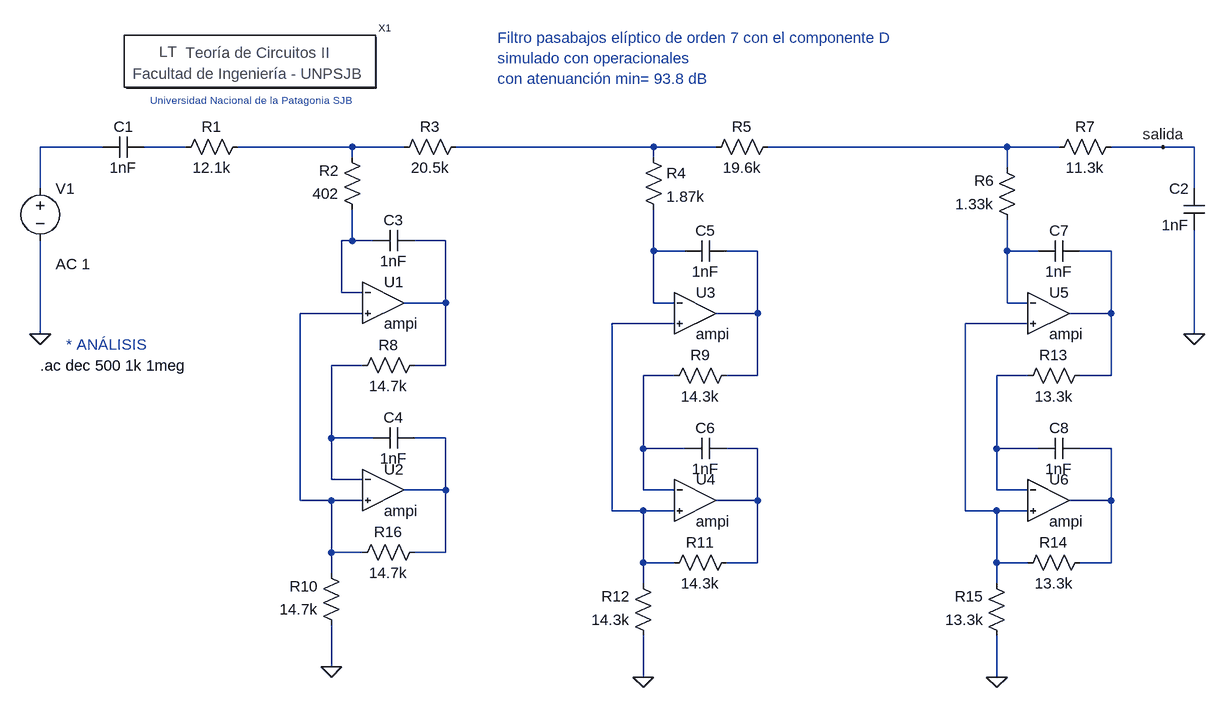
[diagram p0: schematic Filtro eliptico pasabajos de 7 orden con componente D simulado con operacionales.asc]
Filtro eliptico pasabajos de 7 orden con componente D simulado con operacionales.asc, the LTspice schematic file:
Version 4
SHEET 1 880 680
WIRE -944 -352 -1040 -352
WIRE -816 -352 -880 -352
WIRE -560 -352 -736 -352
WIRE -480 -352 -560 -352
WIRE -96 -352 -400 -352
WIRE 0 -352 -96 -352
WIRE 448 -352 80 -352
WIRE 528 -352 448 -352
WIRE 688 -352 608 -352
WIRE 736 -352 688 -352
WIRE -560 -336 -560 -352
WIRE -96 -336 -96 -352
WIRE 448 -320 448 -352
WIRE -1040 -288 -1040 -352
WIRE 736 -288 736 -352
WIRE -560 -208 -560 -256
WIRE -560 -208 -576 -208
WIRE -528 -208 -560 -208
WIRE -416 -208 -464 -208
WIRE -96 -192 -96 -256
WIRE -48 -192 -96 -192
WIRE 64 -192 16 -192
WIRE 448 -192 448 -240
WIRE 496 -192 448 -192
WIRE 608 -192 560 -192
WIRE -576 -128 -576 -208
WIRE -544 -128 -576 -128
WIRE -416 -112 -416 -208
WIRE -416 -112 -480 -112
WIRE -96 -112 -96 -192
WIRE -64 -112 -96 -112
WIRE 448 -112 448 -192
WIRE 480 -112 448 -112
WIRE -544 -96 -640 -96
WIRE 64 -96 64 -192
WIRE 64 -96 0 -96
WIRE 608 -96 608 -192
WIRE 608 -96 544 -96
WIRE -64 -80 -160 -80
WIRE 480 -80 384 -80
WIRE -1040 -64 -1040 -208
WIRE 736 -64 736 -224
WIRE -544 -16 -592 -16
WIRE -416 -16 -416 -112
WIRE -416 -16 -464 -16
WIRE -64 0 -112 0
WIRE 64 0 64 -96
WIRE 64 0 16 0
WIRE 480 0 432 0
WIRE 608 0 608 -96
WIRE 608 0 560 0
WIRE -592 96 -592 -16
WIRE -528 96 -592 96
WIRE -416 96 -464 96
WIRE -112 112 -112 0
WIRE -48 112 -112 112
WIRE 64 112 16 112
WIRE 432 112 432 0
WIRE 496 112 432 112
WIRE 608 112 560 112
WIRE -592 160 -592 96
WIRE -544 160 -592 160
WIRE -416 176 -416 96
WIRE -416 176 -480 176
WIRE -112 176 -112 112
WIRE -64 176 -112 176
WIRE 432 176 432 112
WIRE 480 176 432 176
WIRE -640 192 -640 -96
WIRE -592 192 -640 192
WIRE -544 192 -592 192
WIRE 64 192 64 112
WIRE 64 192 0 192
WIRE 608 192 608 112
WIRE 608 192 544 192
WIRE -160 208 -160 -80
WIRE -112 208 -160 208
WIRE -64 208 -112 208
WIRE 384 208 384 -80
WIRE 432 208 384 208
WIRE 480 208 432 208
WIRE -592 272 -592 192
WIRE -544 272 -592 272
WIRE -416 272 -416 176
WIRE -416 272 -464 272
WIRE -112 288 -112 208
WIRE -64 288 -112 288
WIRE 64 288 64 192
WIRE 64 288 16 288
WIRE 432 288 432 208
WIRE 480 288 432 288
WIRE 608 288 608 192
WIRE 608 288 560 288
WIRE -592 304 -592 272
WIRE -112 320 -112 288
WIRE 432 320 432 288
WIRE -592 448 -592 384
WIRE -112 464 -112 400
WIRE 432 464 432 400
FLAG -592 448 0
FLAG 736 -64 0
FLAG -1040 -64 0
FLAG 688 -352 salida
FLAG -112 464 0
FLAG 432 464 0
SYMBOL voltage -1040 -304 R0
WINDOW 123 24 132 Left 2
WINDOW 39 0 0 Left 2
SYMATTR Value2 AC 1
SYMATTR InstName V1
SYMATTR Value ""
SYMBOL cap -880 -368 R90
WINDOW 0 0 32 VBottom 2
WINDOW 3 32 32 VTop 2
SYMATTR InstName C1
SYMATTR Value 1nF
SYMBOL cap 752 -224 R180
WINDOW 0 24 64 Left 2
WINDOW 3 24 8 Left 2
SYMATTR InstName C2
SYMATTR Value 1nF
SYMBOL res -720 -368 R90
WINDOW 0 0 56 VBottom 2
WINDOW 3 32 56 VTop 2
SYMATTR InstName R1
SYMATTR Value 12.1k
SYMBOL res -544 -240 R180
WINDOW 0 36 76 Left 2
WINDOW 3 36 40 Left 2
SYMATTR InstName R2
SYMATTR Value 402
SYMBOL res -496 -336 R270
WINDOW 0 32 56 VTop 2
WINDOW 3 0 56 VBottom 2
SYMATTR InstName R3
SYMATTR Value 20.5k
SYMBOL res -112 -352 R0
SYMATTR InstName R4
SYMATTR Value 1.87k
SYMBOL res 96 -368 R90
WINDOW 0 0 56 VBottom 2
WINDOW 3 32 56 VTop 2
SYMATTR InstName R5
SYMATTR Value 19.6k
SYMBOL res 464 -224 R180
WINDOW 0 36 76 Left 2
WINDOW 3 36 40 Left 2
SYMATTR InstName R6
SYMATTR Value 1.33k
SYMBOL res 512 -336 R270
WINDOW 0 32 56 VTop 2
WINDOW 3 0 56 VBottom 2
SYMATTR InstName R7
SYMATTR Value 11.3k
SYMBOL ampi -512 -176 R0
SYMATTR InstName U1
SYMBOL ampi -512 112 R0
SYMATTR InstName U2
SYMBOL cap -464 -224 R90
WINDOW 0 0 32 VBottom 2
WINDOW 3 32 32 VTop 2
SYMATTR InstName C3
SYMATTR Value 1nF
SYMBOL cap -464 80 R90
WINDOW 0 0 32 VBottom 2
WINDOW 3 32 32 VTop 2
SYMATTR InstName C4
SYMATTR Value 1nF
SYMBOL res -448 -32 R90
WINDOW 0 0 56 VBottom 2
WINDOW 3 32 56 VTop 2
SYMATTR InstName R8
SYMATTR Value 14.7k
SYMBOL res -448 256 R90
WINDOW 0 0 56 VBottom 2
WINDOW 3 32 56 VTop 2
SYMATTR InstName R16
SYMATTR Value 14.7k
SYMBOL res -576 400 R180
WINDOW 0 36 76 Left 2
WINDOW 3 36 40 Left 2
SYMATTR InstName R10
SYMATTR Value 14.7k
SYMBOL ampi -32 -160 R0
SYMATTR InstName U3
SYMBOL ampi -32 128 R0
SYMATTR InstName U4
SYMBOL cap 16 -208 R90
WINDOW 0 0 32 VBottom 2
WINDOW 3 32 32 VTop 2
SYMATTR InstName C5
SYMATTR Value 1nF
SYMBOL cap 16 96 R90
WINDOW 0 0 32 VBottom 2
WINDOW 3 32 32 VTop 2
SYMATTR InstName C6
SYMATTR Value 1nF
SYMBOL res 32 -16 R90
WINDOW 0 0 56 VBottom 2
WINDOW 3 32 56 VTop 2
SYMATTR InstName R9
SYMATTR Value 14.3k
SYMBOL res 32 272 R90
WINDOW 0 0 56 VBottom 2
WINDOW 3 32 56 VTop 2
SYMATTR InstName R11
SYMATTR Value 14.3k
SYMBOL res -96 416 R180
WINDOW 0 36 76 Left 2
WINDOW 3 36 40 Left 2
SYMATTR InstName R12
SYMATTR Value 14.3k
SYMBOL ampi 512 -160 R0
SYMATTR InstName U5
SYMBOL ampi 512 128 R0
SYMATTR InstName U6
SYMBOL cap 560 -208 R90
WINDOW 0 0 32 VBottom 2
WINDOW 3 32 32 VTop 2
SYMATTR InstName C7
SYMATTR Value 1nF
SYMBOL cap 560 96 R90
WINDOW 0 0 32 VBottom 2
WINDOW 3 32 32 VTop 2
SYMATTR InstName C8
SYMATTR Value 1nF
SYMBOL res 576 -16 R90
WINDOW 0 0 56 VBottom 2
WINDOW 3 32 56 VTop 2
SYMATTR InstName R13
SYMATTR Value 13.3k
SYMBOL res 576 272 R90
WINDOW 0 0 56 VBottom 2
WINDOW 3 32 56 VTop 2
SYMATTR InstName R14
SYMATTR Value 13.3k
SYMBOL res 448 416 R180
WINDOW 0 36 76 Left 2
WINDOW 3 36 40 Left 2
SYMATTR InstName R15
SYMATTR Value 13.3k
SYMBOL Teoría\ de\ Circuitos\ II -720 -480 R0
SYMATTR InstName X1
TEXT -336 -520 Left 2 ;Filtro pasabajos elíptico de orden 7 con el componente D\nsimulado con operacionales\ncon atenuanción min= 93.8 dB
TEXT -1040 -16 Left 2 !.ac dec 500 1k 1meg
TEXT -720 -424 Center 1 ;Universidad Nacional de la Patagonia SJB
TEXT -1000 -48 Left 2 ;* ANÁLISIS

The netlist it stands for:
* Filtro eliptico pasabajos de 7 orden con componente D simulado con operacionales.asc
V1 N001 0 AC 1
C1 N002 N001 1nF
C2 0 salida 1nF
R1 N003 N002 12.1k
R2 N006 N003 402
R3 N003 N004 20.5k
R4 N004 N008 1.87k
R5 N005 N004 19.6k
R6 N010 N005 1.33k
R7 N005 salida 11.3k
XU1 N012 N006 N007 ampi Ren=1e9, Rsal=1, A=1e9  ; pins p n s
XU2 N012 N015 N018 ampi Ren=1e9, Rsal=1, A=1e9  ; pins p n s
C3 N007 N006 1nF
C4 N018 N015 1nF
R8 N007 N015 14.7k
R16 N018 N012 14.7k
R10 0 N012 14.7k
XU3 N013 N008 N009 ampi Ren=1e9, Rsal=1, A=1e9  ; pins p n s
XU4 N013 N016 N019 ampi Ren=1e9, Rsal=1, A=1e9  ; pins p n s
C5 N009 N008 1nF
C6 N019 N016 1nF
R9 N009 N016 14.3k
R11 N019 N013 14.3k
R12 0 N013 14.3k
XU5 N014 N010 N011 ampi Ren=1e9, Rsal=1, A=1e9  ; pins p n s
XU6 N014 N017 N020 ampi Ren=1e9, Rsal=1, A=1e9  ; pins p n s
C7 N011 N010 1nF
C8 N020 N017 1nF
R13 N011 N017 13.3k
R14 N020 N014 13.3k
R15 0 N014 13.3k
XX1 Teoría de Circuitos II
* Filtro pasabajos elíptico de orden 7 con el componente D
* simulado con operacionales
* con atenuanción min= 93.8 dB
.ac dec 500 1k 1meg
* Universidad Nacional de la Patagonia SJB
* * ANÁLISIS
.lib ..\sym\Circuitos2\ComponentesIdeales\compoideales.lib
.backanno
.end